# Altium schematic sheet Tone_board.SchDoc
size A
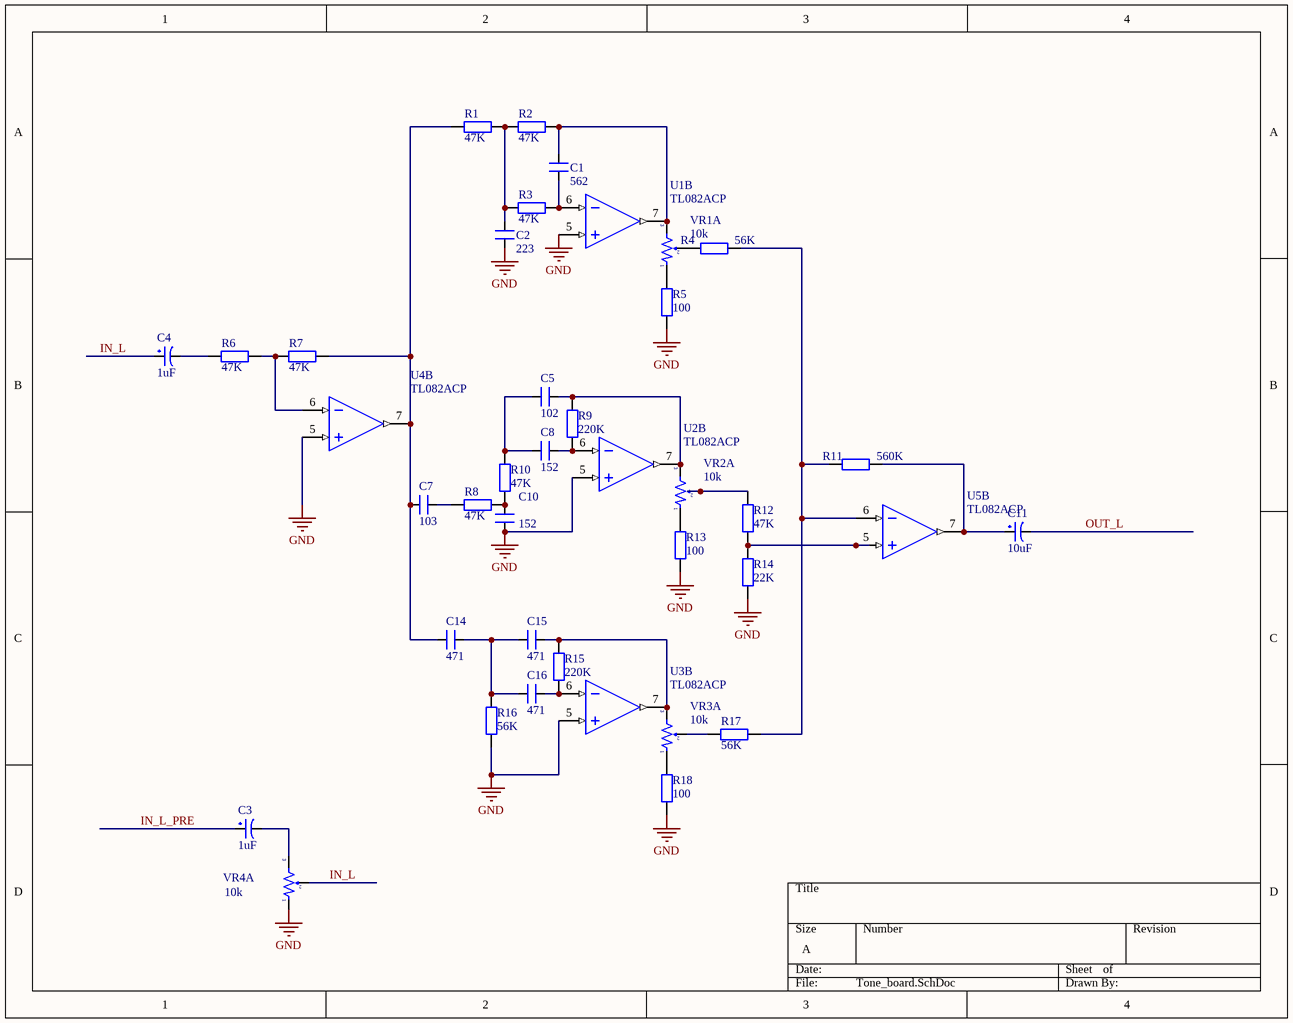
[diagram p0: Tone_board.SchDoc]

## Parts
C1  562  [WIMA-FKP-2-1nF]
C2  223  [WIMA-FKP-2-1nF]
C3  1uF  [CP1/3.0]
C4  1uF  [CP1/3.0]
C5  102  [WIMA-FKP-2-1nF]
C7  103  [WIMA-FKP-2-1nF]
C8  152  [WIMA-FKP-2-1nF]
C10  152  [WIMA-FKP-2-1nF]
C11  10uF  [CP1/3.0]
C14  471  [WIMA-FKP-2-1nF]
C15  471  [WIMA-FKP-2-1nF]
C16  471  [WIMA-FKP-2-1nF]
R1  47K  [TRO_VACH_ 1/4W]
R2  47K  [TRO_VACH_ 1/4W]
R3  47K  [TRO_VACH_ 1/4W]
R4  56K  [TRO_VACH_ 1/4W]
R5  100  [TRO_VACH_ 1/4W]
R6  47K  [TRO_VACH_ 1/4W]
R7  47K  [TRO_VACH_ 1/4W]
R8  47K  [TRO_VACH_ 1/4W]
R9  220K  [TRO_VACH_ 1/4W]
R10  47K  [TRO_VACH_ 1/4W]
R11  560K  [TRO_VACH_ 1/4W]
R12  47K  [TRO_VACH_ 1/4W]
R13  100  [TRO_VACH_ 1/4W]
R14  22K  [TRO_VACH_ 1/4W]
R15  220K  [TRO_VACH_ 1/4W]
R16  56K  [TRO_VACH_ 1/4W]
R17  56K  [TRO_VACH_ 1/4W]
R18  100  [TRO_VACH_ 1/4W]
U1  TL082ACP  [DIP8]  (part B of 2)
U2  TL082ACP  [DIP8]  (part B of 2)
U3  TL082ACP  [DIP8]  (part B of 2)
U4  TL082ACP  [DIP8]  (part B of 2)
U5  TL082ACP  [DIP8]  (part B of 2)
VR1  10k  [9011]  (part A of 2)
VR2  10k  [9011]  (part A of 2)
VR3  10k  [9011]  (part A of 2)
VR4  10k  [9011]  (part A of 2)

## Nets
GND: C2.1 C10.2 R5.1 R13.1 R14.1 R16.1 R18.1 U1.5(IN+) U2.5(IN+) U3.5(IN+) U4.5(IN+) VR4.1
IN_L: C4.1 VR4.2
IN_L_PRE: C3.1
OUT_L: C11.2
NetC1_1: C1.1 R3.2 U1.6(IN-)
NetC1_2: C1.2 R2.2 U1.7(OUT) VR1.3
NetC2_2: C2.2 R1.2 R2.1 R3.1
NetC3_2: C3.2 VR4.3
NetC4_2: C4.2 R6.1
NetC5_1: C5.1 R9.2 U2.7(OUT) VR2.3
NetC5_2: C5.2 C8.2 R10.1
NetC7_1: C7.1 C14.2 R1.1 R7.2 U4.7(OUT)
NetC7_2: C7.2 R8.2
NetC8_1: C8.1 R9.1 U2.6(IN-)
NetC10_1: C10.1 R8.1 R10.2
NetC11_1: C11.1 R11.1 U5.7(OUT)
NetC14_1: C14.1 C15.2 C16.2 R16.2
NetC15_1: C15.1 R15.2 U3.7(OUT) VR3.3
NetC16_1: C16.1 R15.1 U3.6(IN-)
NetR4_1: R4.1 R11.2 R17.1 U5.6(IN-)
NetR4_2: R4.2 VR1.2
NetR5_2: R5.2 VR1.1
NetR6_2: R6.2 R7.1 U4.6(IN-)
NetR12_1: R12.1 R14.2 U5.5(IN+)
NetR12_2: R12.2 VR2.2
NetR13_2: R13.2 VR2.1
NetR17_2: R17.2 VR3.2
NetR18_2: R18.2 VR3.1

## Library data of the parts
C1 C2 C5 C7 C8 C10 C14-C16 = TU_MICA_ 104 100V(2A104J)_MH: Value: 0.1uF
C3 C4 C11 = TU_HOA_4.7uF_100V_MH: Value: 4700uF/50V
R1-R18 = TRO_VACH_1/2W_MH: Resistor; Value: 1K; Published: 8-Jun-2000; LatestRevisionDate: 17-Jul-2002; LatestRevisionNote: Re-released for DXP Platform.; Publisher: Altium Limited
U1-U5 = TL082ACP: JFET-Input Operational Amplifier; Published: 17-Jul-2002; LatestRevisionDate: 06-Jun-2005; LatestRevisionNote: Stylized 3D Model Added.; DatasheetVersion: 1988; PackageReference: 626-05; Publisher: Altium Limited; PackageDescription: DIP; 8 Leads; Row Spacing 7.62 mm; Pitch 2.54 mm; ComponentLink1Description: Manufacturer Link; ComponentLink1URL: http://www.onsemi.com/site/products/parametrics/0,4446,251,00.html
VR1-VR4 = Triet Ap Doi 10k_MH: Triet Ap Doi 10k